# Altium project adapter_pcb_bioGAPv2.PrjPcb
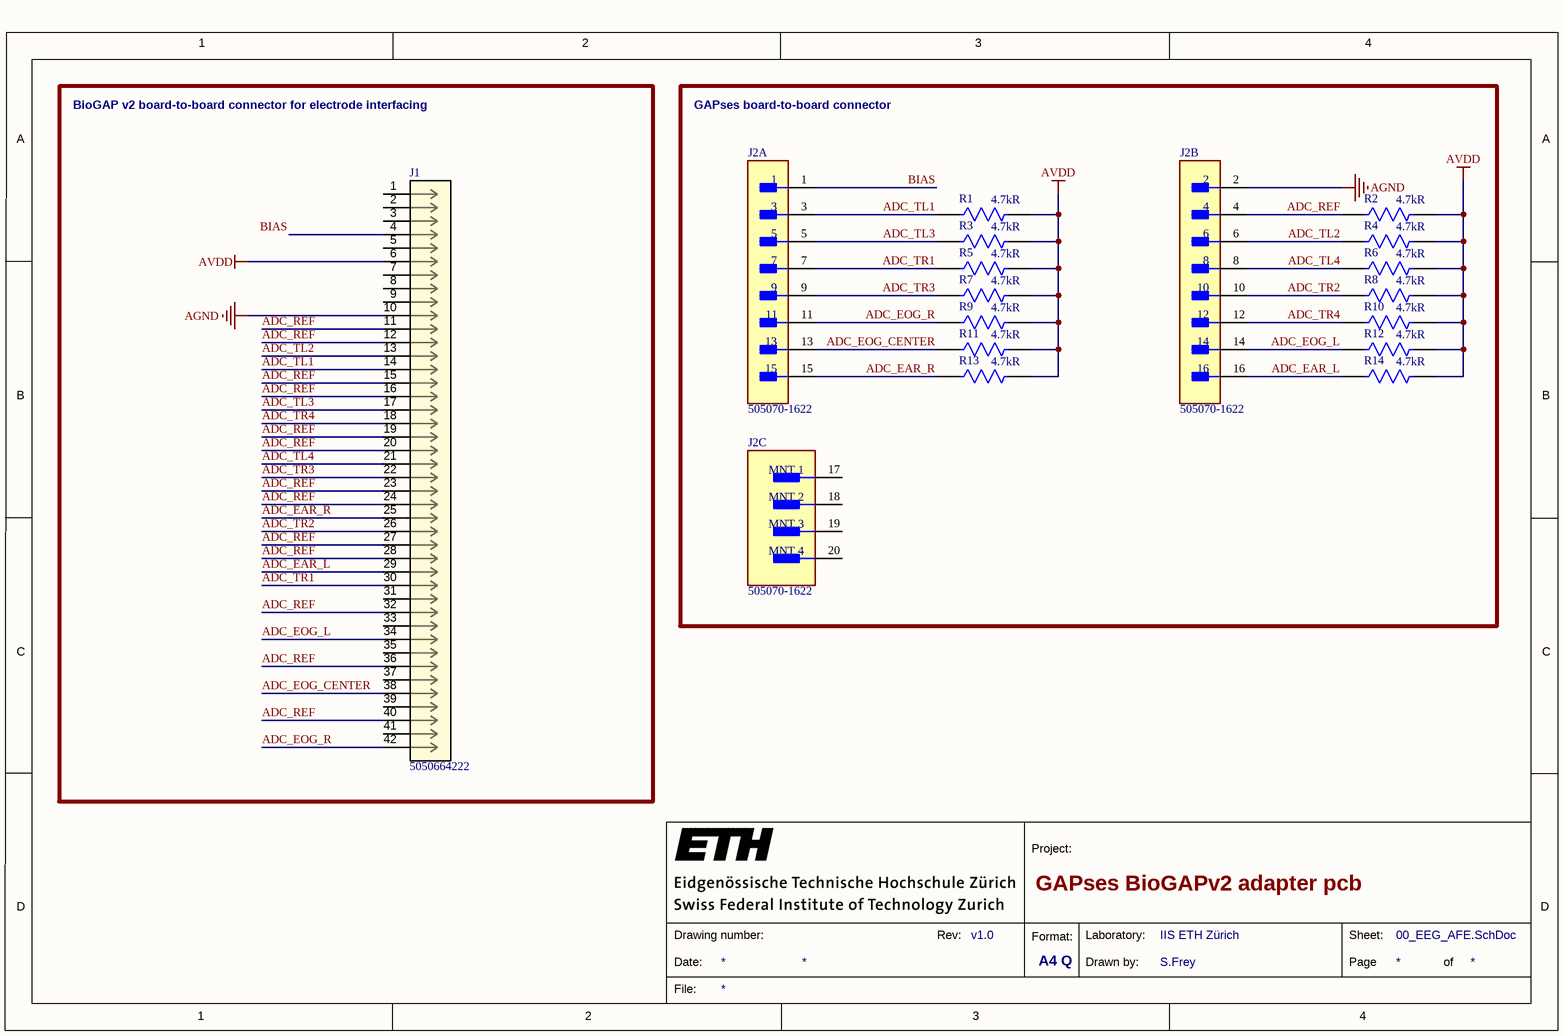
[diagram p0: 00_EEG_AFE.SchDoc]
DrawnBy: S.Frey; Organization: IIS ETH Zürich; revision: v1.0; title: GAPses breakout pcb
1 sheet, 16 parts. Net scope: global (net labels, ports and power ports of the same name join across sheets).
Board file: adapter_pcb_bioGAPv2.PcbDoc

## Sheet 00_EEG_AFE.SchDoc: GAPses BioGAPv2 adapter pcb
size A4

### Parts
J1  5050664222  [CONN_5050664222_MOL]
J2  505070-1622  [FP-505070-1622-MFG]  (parts A,B,C of 3)
R1  Resistance: 4.7kR  [FP-RR0510-IPC_C]  (hidden comment: RR0510P-472-D)
R2  Resistance: 4.7kR  [FP-RR0510-IPC_C]  (hidden comment: RR0510P-472-D)
R3  Resistance: 4.7kR  [FP-RR0510-IPC_C]  (hidden comment: RR0510P-472-D)
R4  Resistance: 4.7kR  [FP-RR0510-IPC_C]  (hidden comment: RR0510P-472-D)
R5  Resistance: 4.7kR  [FP-RR0510-IPC_C]  (hidden comment: RR0510P-472-D)
R6  Resistance: 4.7kR  [FP-RR0510-IPC_C]  (hidden comment: RR0510P-472-D)
R7  Resistance: 4.7kR  [FP-RR0510-IPC_C]  (hidden comment: RR0510P-472-D)
R8  Resistance: 4.7kR  [FP-RR0510-IPC_C]  (hidden comment: RR0510P-472-D)
R9  Resistance: 4.7kR  [FP-RR0510-IPC_C]  (hidden comment: RR0510P-472-D)
R10  Resistance: 4.7kR  [FP-RR0510-IPC_C]  (hidden comment: RR0510P-472-D)
R11  Resistance: 4.7kR  [FP-RR0510-IPC_C]  (hidden comment: RR0510P-472-D)
R12  Resistance: 4.7kR  [FP-RR0510-IPC_C]  (hidden comment: RR0510P-472-D)
R13  Resistance: 4.7kR  [FP-RR0510-IPC_C]  (hidden comment: RR0510P-472-D)
R14  Resistance: 4.7kR  [FP-RR0510-IPC_C]  (hidden comment: RR0510P-472-D)

### Blocks framed on the sheet
BioGAP v2 board-to-board connector for electrode interfacing: J1
GAPses board-to-board connector: J2 R1-R14

### Nets
AGND: J1.10 J2.2
AVDD: J1.6 R1.2 R2.2 R3.2 R4.2 R5.2 R6.2 R7.2 R8.2 R9.2 R10.2 R11.2 R12.2 R13.2 R14.2
ADC_EAR_L: J1.29 J2.16 R14.1
ADC_EAR_R: J1.25 J2.15 R13.1
ADC_EOG_CENTER: J1.38 J2.13 R11.1
ADC_EOG_L: J1.34 J2.14 R12.1
ADC_EOG_R: J1.42 J2.11 R9.1
ADC_REF: J1.11 J1.12 J1.15 J1.16 J1.19 J1.20 J1.23 J1.24 J1.27 J1.28 J1.32 J1.36 J1.40 J2.4 R2.1
ADC_TL1: J1.14 J2.3 R1.1
ADC_TL2: J1.13 J2.6 R4.1
ADC_TL3: J1.17 J2.5 R3.1
ADC_TL4: J1.21 J2.8 R6.1
ADC_TR1: J1.30 J2.7 R5.1
ADC_TR2: J1.26 J2.10 R8.1
ADC_TR3: J1.22 J2.9 R7.1
ADC_TR4: J1.18 J2.12 R10.1
BIAS: J1.4 J2.1

Not connected (* = marked no-connect by the designer): J1 1 2 3 5 7 8 9 31 33 35 37 39 41; J2 17(MNT_1) 18(MNT_2) 19(MNT_3) 20(MNT_4)

### Notes on the sheet
- 1
- 2
- 3
- 4
- A
- B
- C
- Project:
- D
- Date:
- Drawing number:
- Rev:
- Format:
- A4 Q
- Drawn by:
- Laboratory:
- Page
- Sheet:
- of
- File:

### Library data of the parts
J1 = 5050664222: No Description Available; Mfr_Name: Molex Connector Corporation; RefDes: RefDes; Type: Type
J2 = CMP-04776-000181-1: CONN PLUG 16POS SMD GOLD
R1-R14 = CMP-2002-01621-2: 4.7kΩ ±0.5% 0.0625W 1/16W Chip Resistor 0402 (1005 Metric) Thin Film; Temperature Coefficient: 25ppm/°C; Voltage Rating: 25V; Power Rating: 63mW; Tolerance: 0.5%; Size Code: 0402; Lead Free: Lead Free; Length: 0.039inch; Termination: SMD/SMT; Resistor Type: Thin Film; Voltage Rating (DC): 25V; Resistance Tolerance: 0.5%; Packaging: Cut Tape; Case/Package: 0402; Number of Terminations: 2; Width: 0.02inch; Height: 0.016inch; Case Code (Metric): 1005; Min Operating Temperature: -55°C; Max Power Dissipation: 63mW; RoHS Compliant: Yes; Series: RR; Weight: 2.3E-05oz; Number of Pins: 2; Case Code (Imperial): 0402; Max Operating Temperature: 125°C; Package Quantity: 1

## Assembly variants
Only fitted: all parts fitted